# Altium schematic sheet 04 GPIO ASSIGNMENT.SchDoc
size 420 x 297 mm; Organization: Altium Limited; Address1: L3, 12a Rodborough Rd; Address2: Frenchs Forest; Address3: NSW; Address4: Australia 2086
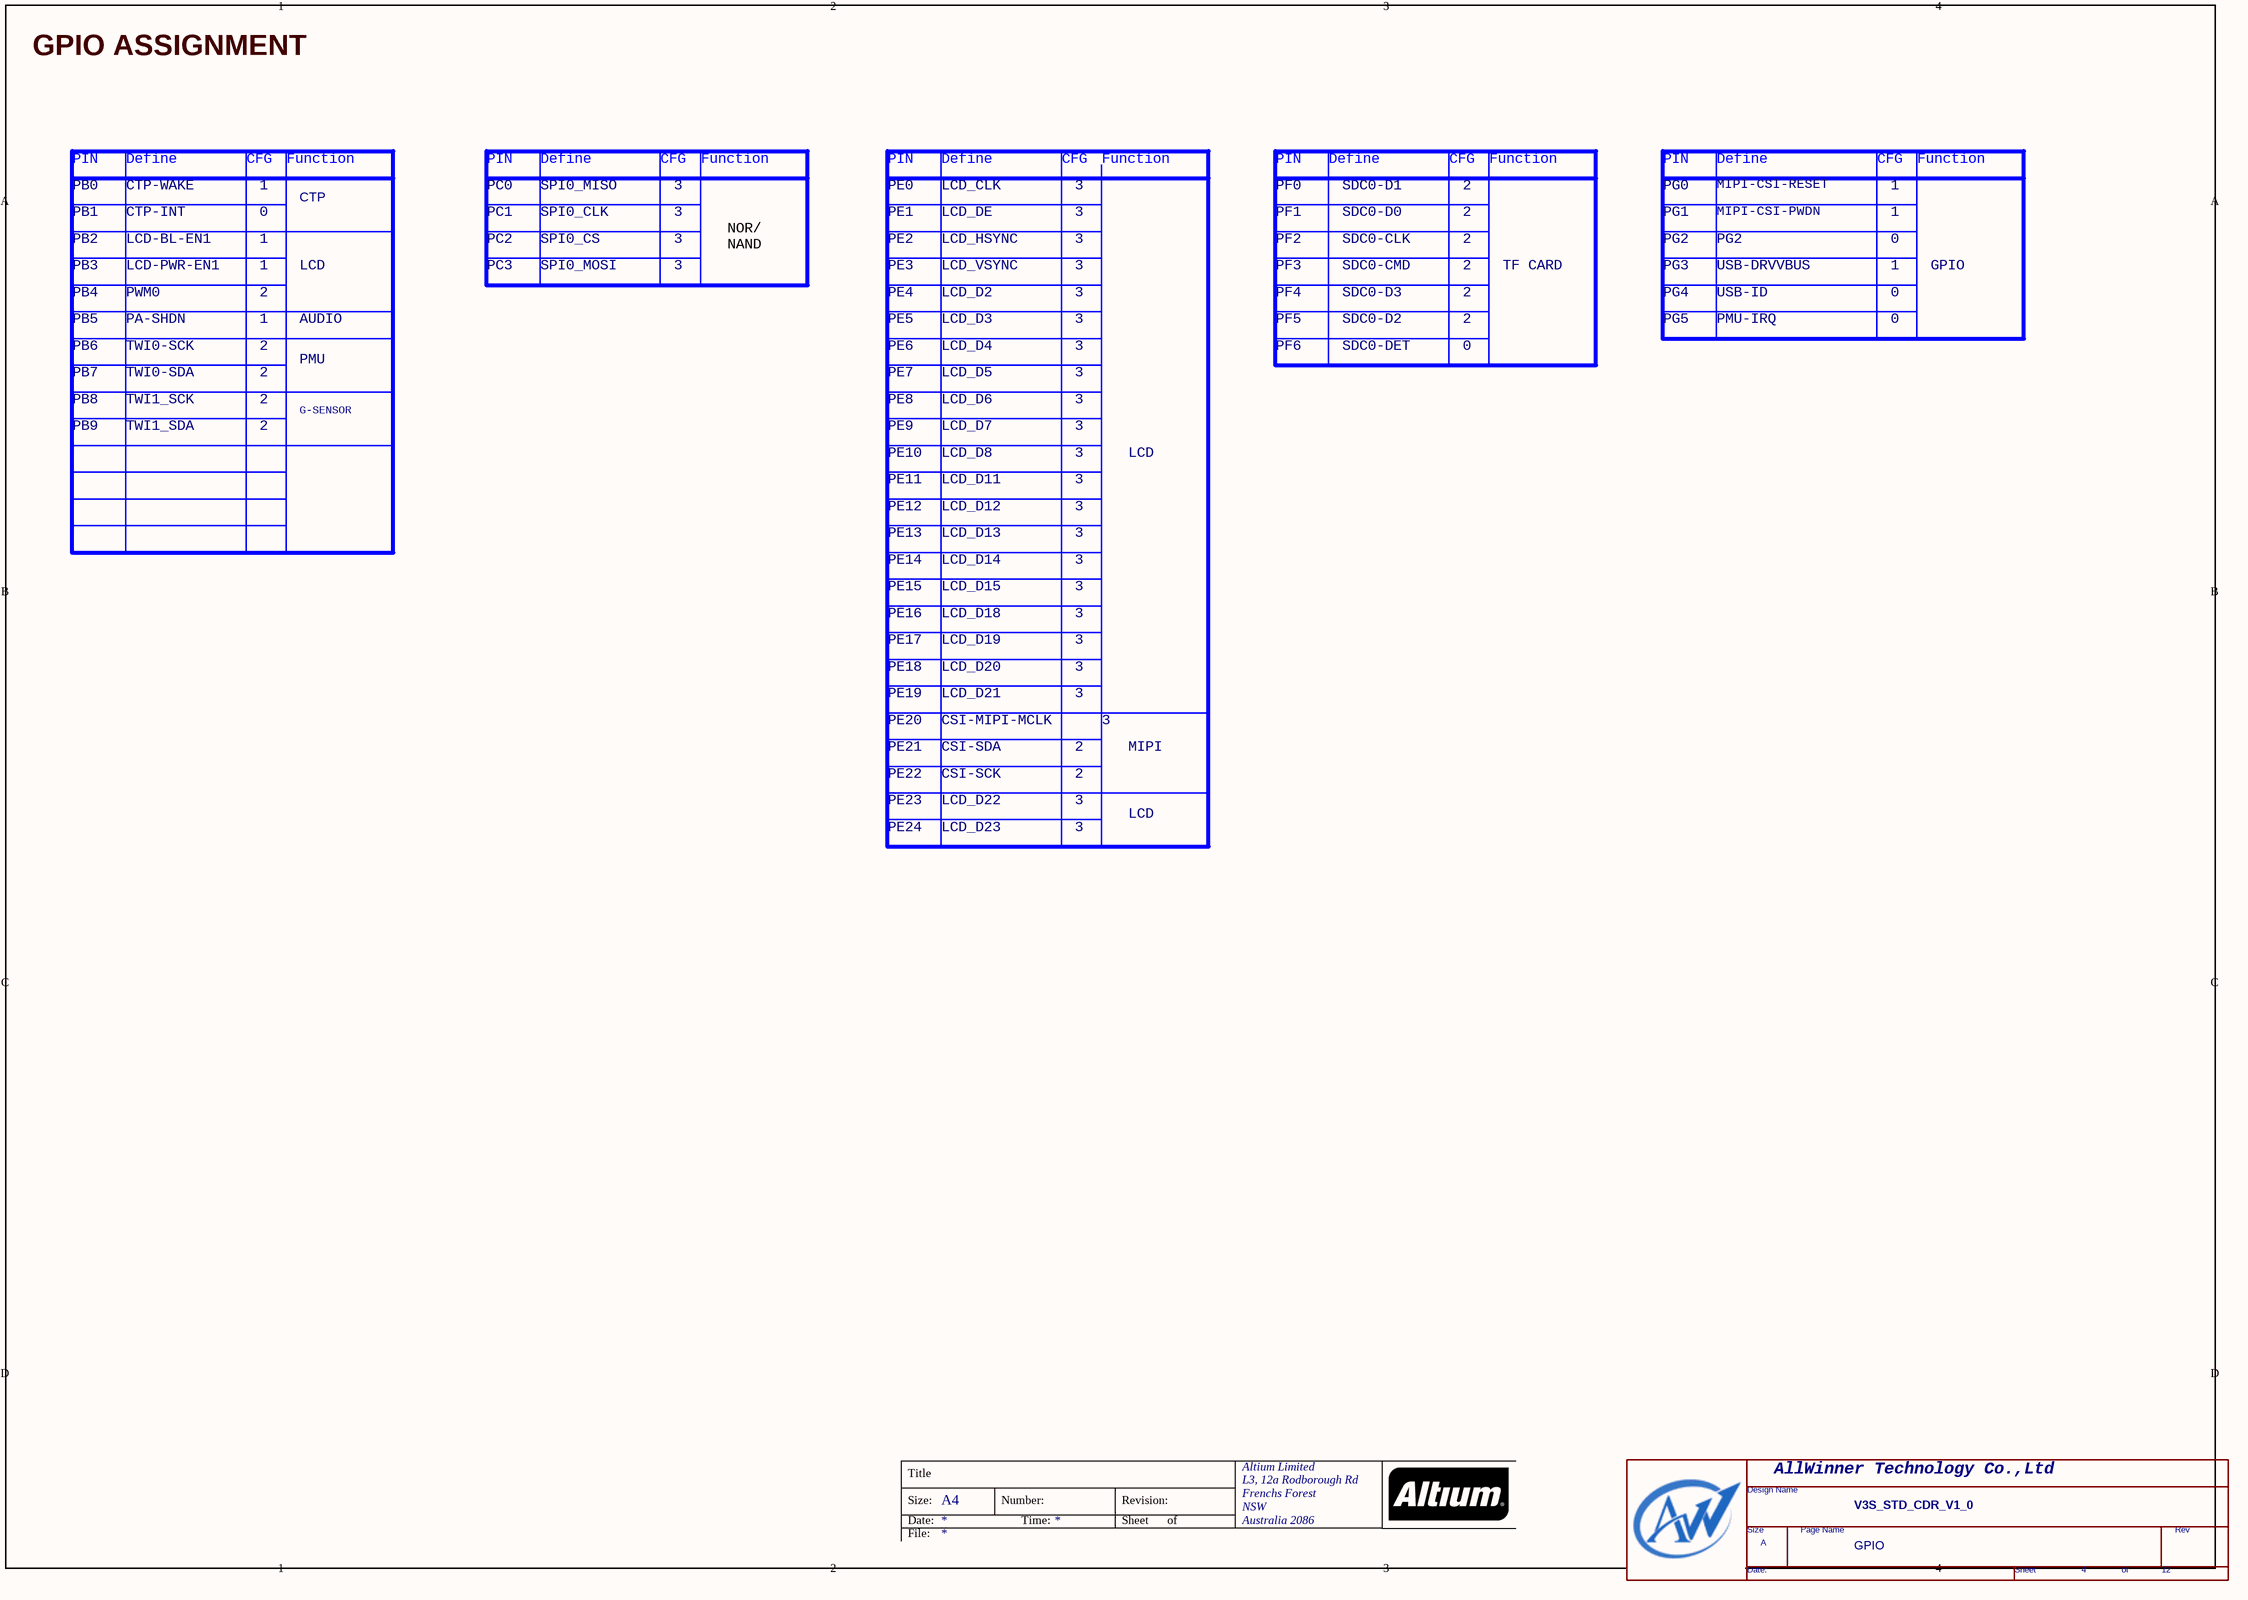
[diagram p0: 04 GPIO ASSIGNMENT.SchDoc]

## Parts
*  Page Count: 12  Page Number: 4  Page Size: A  Title: V3S_STD_CDR_V1_0  Doc: GPIO  (hidden comment: TitleBlock0-AW)  (graphical)

## Notes on the sheet
- GPIO ASSIGNMENT
- PIN
- PB0
- Define
- CTP-WAKE
- CFG
- 1
- Function
- PC0
- SPI0_MISO
- 3
- PE0
- LCD_CLK
- PF0
- SDC0-D1
- 2
- PG0
- MIPI-CSI-RESET
- PB1
- PB2
- CTP-INT
- LCD-BL-EN1
- 0
- CTP
- PC1
- PC2
- SPI0_CLK
- SPI0_CS
- NOR/
  NAND
- PE1
- PE2
- LCD_DE
- LCD_HSYNC
- PF1
- PF2
- SDC0-D0
- SDC0-CLK
- PG1
- PG2
- MIPI-CSI-PWDN
- PB3
- PB4
- PB5
- LCD-PWR-EN1
- PWM0
- PA-SHDN
- LCD
- AUDIO
- PC3
- SPI0_MOSI
- PE3
- PE4
- PE5
- LCD_D3
- LCD_D2
- LCD_VSYNC
- PF3
- PF4
- PF5
- SDC0-D2
- SDC0-D3
- SDC0-CMD
- TF CARD
- PG3
- PG4
- PG5
- USB-ID
- PMU-IRQ
- USB-DRVVBUS
- GPIO
- PB6
- PB7
- TWI0-SDA
- TWI0-SCK
- PMU
- PE6
- PE7
- LCD_D4
- LCD_D5
- PF6
- SDC0-DET
- PB8
- PB9
- TWI1_SCK
- TWI1_SDA
- G-SENSOR
- PE8
- PE9
- PE10
- LCD_D6
- LCD_D7
- LCD_D8
- PE11
- PE12
- LCD_D11
- LCD_D12
- PE13
- PE14
- PE15
- LCD_D15
- LCD_D14
- LCD_D13
- PE16
- PE17
- LCD_D19
- LCD_D18
- PE18
- PE19
- PE20
- LCD_D21
- LCD_D20
- CSI-MIPI-MCLK
- PE21
- PE22
- CSI-SDA
- CSI-SCK
- MIPI
- PE23
- PE24
- LCD_D23
- LCD_D22
- Title
- Size:
- Date:
- A4
- Number:
- Time:
- Revision:
- Sheet
- of
- File:
- (in symbol TitleBlock0-AW) AllWinner Technology Co.,Ltd; Design Name; Size; Page Name; Rev; Date:; Sheet; of

## Library data of the parts
* = TitleBlock0-AW: RevCode: 0.1; Page Create Date: March  8, 1995